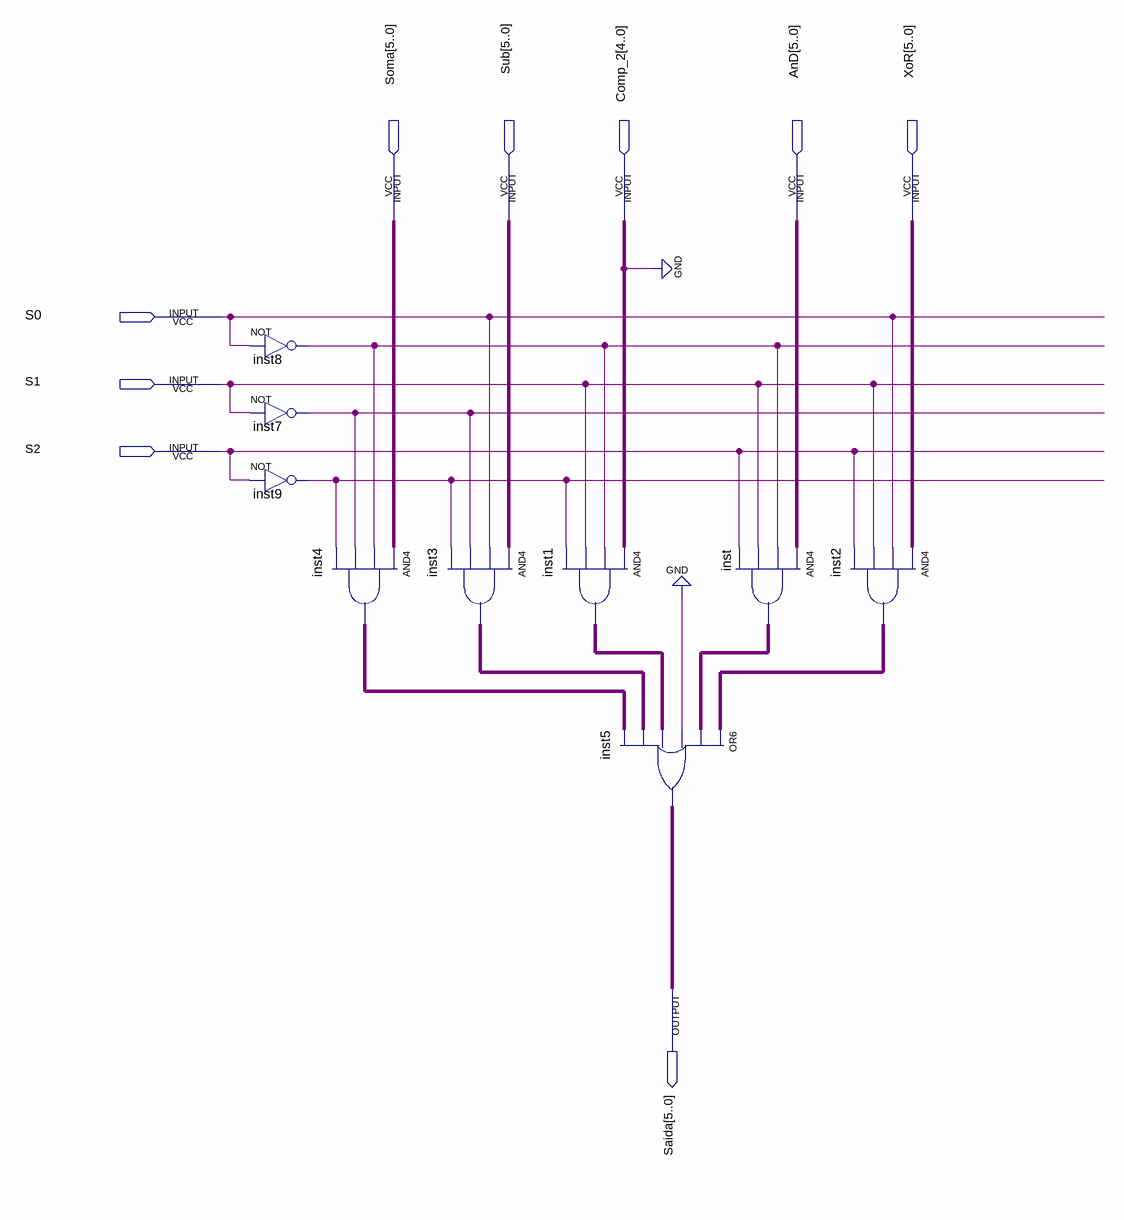
[diagram p0: schematic sheet]
// Quartus schematic Mux8_1_vetor.bdf as structural Verilog: 9 symbols, 9 pins
module Mux8_1_vetor (
  input  [5:0] Soma,
  input  [5:0] Sub,
  input  [4:0] Comp_2,
  input  [5:0] AnD,
  input  [5:0] XoR,
  input  S0,
  input  S1,
  input  S2,
  output [5:0] Saida
);

  wire inst7_out, inst8_out, inst9_out;
  wire [5:0] inst1_out, inst2_out, inst3_out, inst4_out, inst_out;

  not inst8 (inst8_out, S0);
  not inst7 (inst7_out, S1);
  not inst9 (inst9_out, S2);
  assign inst4_out = Soma & {6{inst8_out}} & {6{inst7_out}} & {6{inst9_out}};  // AND4 inst4, 6 bits wide
  assign inst3_out = Sub & {6{S0}} & {6{inst7_out}} & {6{inst9_out}};  // AND4 inst3, 6 bits wide
  assign inst1_out = Comp_2 & {6{inst8_out}} & {6{S1}} & {6{inst9_out}};  // AND4 inst1, 6 bits wide
  assign Saida = inst2_out | inst_out | {6{1'b0}} | inst1_out | inst3_out | inst4_out;  // OR6 inst5, 6 bits wide
  assign inst_out = AnD & {6{inst8_out}} & {6{S1}} & {6{S2}};  // AND4 inst, 6 bits wide
  assign inst2_out = XoR & {6{S0}} & {6{S1}} & {6{S2}};  // AND4 inst2, 6 bits wide
endmodule
